# Altium schematic sheet SUPI_MediumR2.SchDoc
size 558 x 431 mm; SheetNumber: 1; SheetTotal: 4
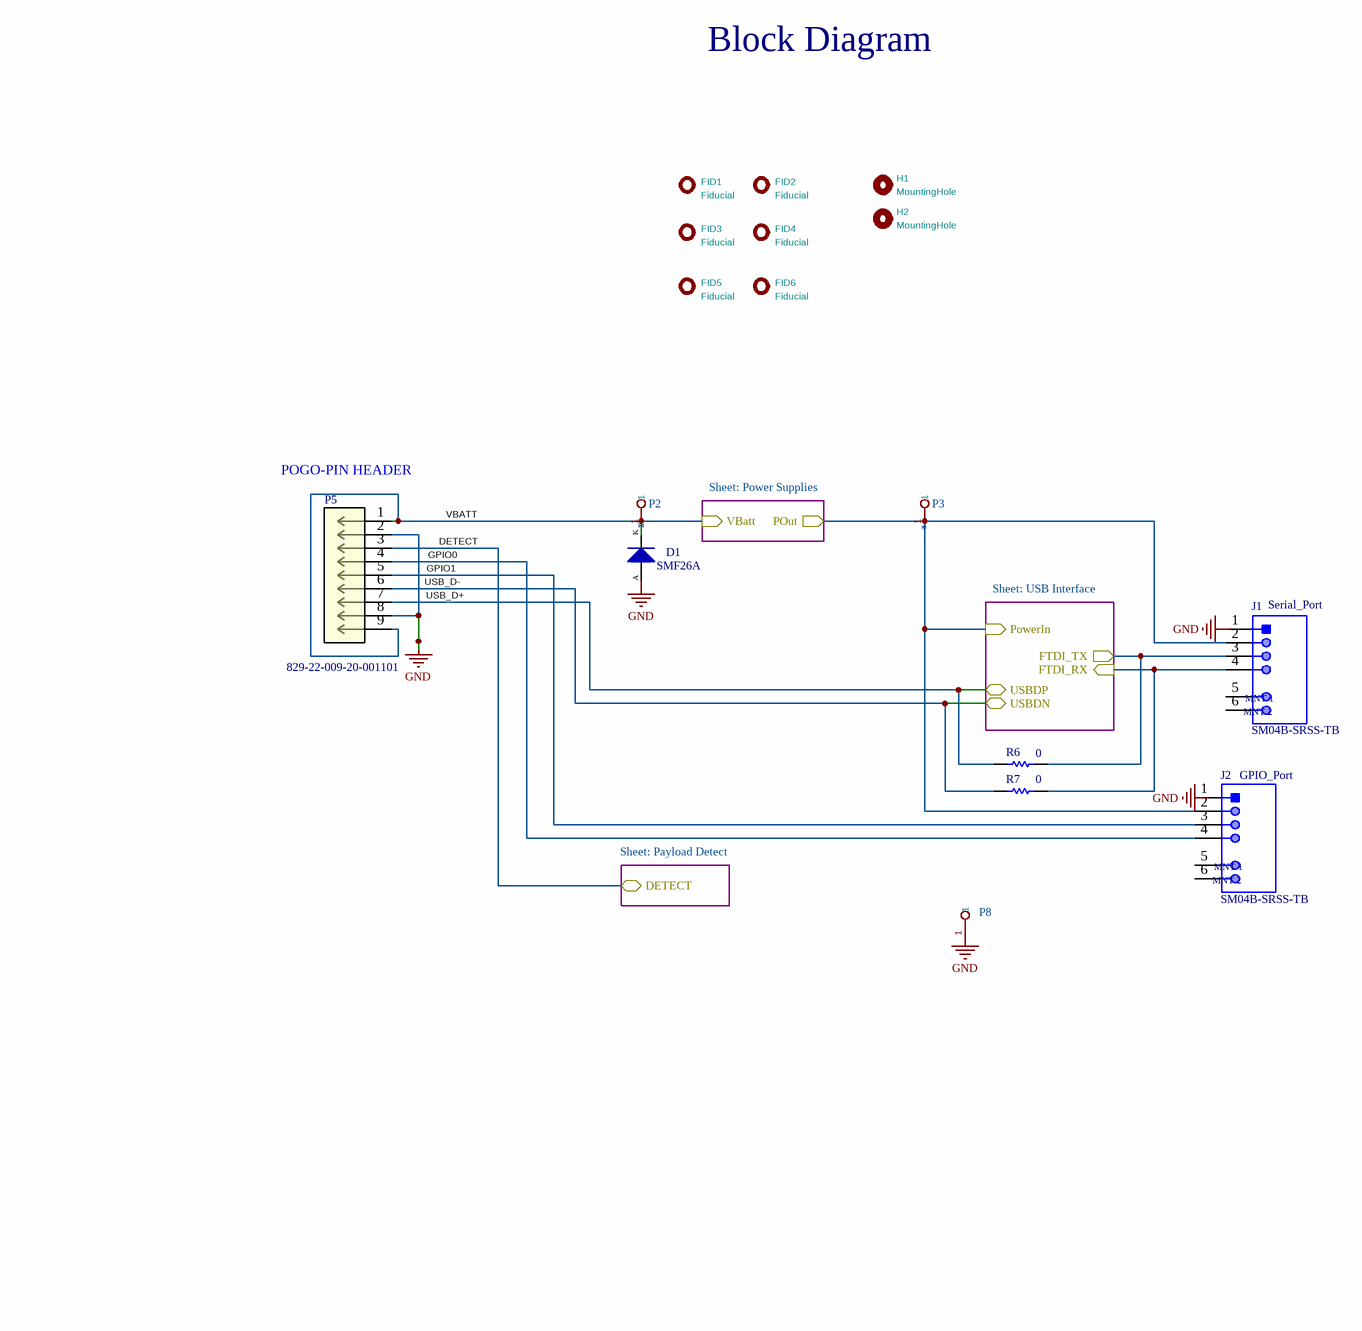
[diagram p0: SUPI_MediumR2.SchDoc]

## Parts
D1  SMF26A  [DI-SOD123F-A]
FID1  Fiducial  [Fiducial_Cu0.040_Mask0.060]  (no BOM)
FID2  Fiducial  [Fiducial_Cu0.040_Mask0.060]  (no BOM)
FID3  Fiducial  [Fiducial_Cu0.040_Mask0.060]  (no BOM)
FID4  Fiducial  [Fiducial_Cu0.040_Mask0.060]  (no BOM)
FID5  Fiducial  [Fiducial_Cu0.040_Mask0.060]  (no BOM)
FID6  Fiducial  [Fiducial_Cu0.040_Mask0.060]  (no BOM)
H1  MountingHole  [MountingHole_2.2mm_M2_DIN965]  (no BOM)
H2  MountingHole  [MountingHole_2.2mm_M2_DIN965]  (no BOM)
J1  SM04B-SRSS-TB  [SM04B-SRSS-TB]
J2  SM04B-SRSS-TB  [SM04B-SRSS-TB]
P2  *  [TP_SMD_1MM]  (no BOM)
P3  *  [TP_SMD_1MM]  (no BOM)
P5  829-22-009-20-001101  [829-22-009-20-001101]
P8  (no value)  [TP_SMD_1MM]  (no BOM)
R6  value 0  [RES-0402-A]  (hidden comment: Res 0402 0 Ohm 1/16W 5% Thick Film)
R7  value 0  [RES-0402-A]  (hidden comment: Res 0402 0 Ohm 1/16W 5% Thick Film)

## Sub-sheets
Payload Detect = payload_detect.SchDoc: DETECT (bidir)
Power Supplies = power_supplies.SchDoc: POut (out), VBatt (in)
USB Interface = SOUP_USB.SchDoc: FTDI_RX (in), FTDI_TX (out), USBDN (bidir), USBDP (bidir), PowerIn (in)

## Nets
GND: P5.2 P5.8 P8.1
DETECT: P5.3 ; sheet Payload Detect/DETECT
GPIO0: J2.4 P5.4
GPIO1: J2.3 P5.5
USB_D+: P5.7 R6.1 ; sheet USB Interface/USBDP
USB_D-: P5.6 R7.1 ; sheet USB Interface/USBDN
VBATT: D1.K P2.1 P5.1 P5.9 ; sheet Power Supplies/VBatt
NetJ1_2: J1.2 J2.2 P3.1 ; sheet USB Interface/PowerIn, sheet Power Supplies/POut
NetJ1_3: J1.3 R6.2 ; sheet USB Interface/FTDI_TX
NetJ1_4: J1.4 R7.2 ; sheet USB Interface/FTDI_RX

Not connected (* = marked no-connect by the designer): D1 A; J1 1 5 6; J2 1 5 6

## Notes on the sheet
- Block Diagram
- (near P5) POGO-PIN HEADER
- Sheet: Power Supplies
- Sheet: USB Interface
- (near J1) Serial_Port
- (near J2) GPIO_Port
- Sheet: Payload Detect
- Labels drawn without touching a wire or pin: GND
- REVISIONS
- REVISION
- DESCRIPTION
- DATE(YEAR-MO-DA)
- APPROVED
- DWG NO
- SH
- THIS DRAWING IS CAD MAINTAINED.
  CHANGES SHALL BE INCORPORATED
  BY THE DESIGN ACTIVITY.
- PART NO.
- CONTRACT NUMBER
- DESIGN ACTIVITY
- CONTRACTOR
- US ARMY
  COMBAT CAPABILITIES DEVELOPMENT COMMAND ARMAMENTS CENTER
  PICATINNY ARSENAL, NEW JERSEY 07806-5000
- DRAWN BY
- ENGINEER
- CHECKER
- QUALITY ENGINEER
- DRAWING APPROVAL
- SIZE
- CAGE CODE
- DWG NO.
- NEXT ASSY
- USED ON
- DESIGN APPROVAL
- C
- 19200
- APPLICATION
- SCALE
- NONE
- UNIT WT.
- ---
- SHEET
- (in symbol CONN-00456-1) MNT 1; MNT 2

## Library data of the parts
D1 = CMP-00657-2: SMF Series 200 W 26 V Uni-Directional Surface Mount TVS Diode - SOD-123F; Breakdown Voltage: 30.4V; Clamping Voltage: 42.1V; Max Breakdown Voltage: 31.9V; Max Power Dissipation: 1W; Max Reverse Leakage Current: 1µA; Max Surge Current: 4.8A; Min Breakdown Voltage: 28.9V; Number of Channels: 1; Peak Pulse Power: 1kW; Polarity: Unidirectional; Power Line Protection: No; Reverse Standoff Voltage: 26V; Test Current: 1mA; Composition: Zener; Lead Free: Lead Free; Lifecycle Status: Production; Max Operating Temperature: 150°C; Min Operating Temperature: -65°C; Mounting Technology: Surface Mount; Number of Elements: 1; Number of Terminals: 2; Number of Unidirectional Channels: 1; Packaging: Cut Tape; Peak Pulse Current: 4.8A; Peak Reverse Current: 1µA; REACH SVHC: No; Reverse Voltage: 26V; RoHS: Compliant; Schedule B: 8541100080; Termination: SMD/SMT
FID1-FID6 = Fiducial_40mil_mask_60mil: Value: Fiducial
J1 J2 = CONN-00456-1: Conn Shrouded Header (4 Sides) HDR 4 POS 1.25mm Solder RA Side Entry SMD T/R; Connector Type: Male Pin; Number of Contacts: 4; Pitch: 990.6µm; Pin Count: 4; Pins: 6; Number of Positions: 4; Number of Rows: 1; Orientation: Right Angle
P2 P3 P8 = Hand_Solder_Pad_100x80_mil
P5 = CONN-00457-1: Board Connector, 9 Contact(s), 1 Row(s), Male, Right Angle, Solder Terminal; Leader Qty: 5; Number of Contacts: 9; Pitch: 2.54mm; System: Connector; Contact Gender: Male; Contact Plating: Gold; Number of Rows: 1; Termination: Solder
R6 R7 = RES-00249-8: Leader Qty: 100; Case/Package: 0402; Max Operating Temperature: 155°C; Min Operating Temperature: -55°C; RoHS Compliant: Yes
H1 H2 = MountingHole: Value: MountingHole